# Altium schematic sheet AIM2 - MOD REVB.SchDoc: Modification Information
size B; DrawnBy: DJW; DocumentNumber: 10; SheetNumber: 10; SheetTotal: 12
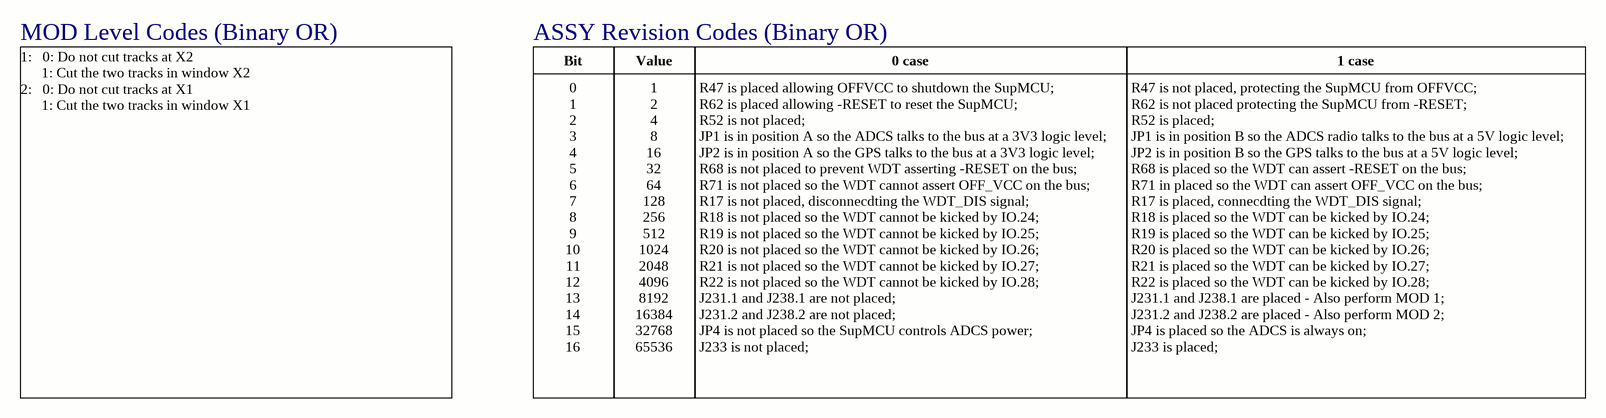
[diagram p0: AIM2 - MOD REVB.SchDoc]

## Notes on the sheet
- MOD Level Codes (Binary OR)
- ASSY Revision Codes (Binary OR)
- Bit
- Value
- 0 case
- 1 case
- 1:   0: Do not cut tracks at X2
  1: Cut the two tracks in window X2
  2:   0: Do not cut tracks at X1
  1: Cut the two tracks in window X1
- 0
  1
  2
  3
  4
  5
  6
  7
  8
  9
  10
  11
  12
  13
  14
  15
  16
- 1
  2
  4
  8
  16
  32
  64
  128
  256
  512
  1024
  2048
  4096
  8192
  16384
  32768
  65536
- R47 is placed allowing OFFVCC to shutdown the SupMCU;
  R62 is placed allowing -RESET to reset the SupMCU;
  R52 is not placed;
  JP1 is in position A so the ADCS talks to the bus at a 3V3 logic level;
  JP2 is in position A so the GPS talks to the bus at a 3V3 logic level;
  R68 is not placed to prevent WDT asserting -RESET on the bus;
  R71 is not placed so the WDT cannot assert OFF_VCC on the bus;
  R17 is not placed, disconnecdting the WDT_DIS signal;
  R18 is not placed so the WDT cannot be kicked by IO.24;
  R19 is not placed so the WDT cannot be kicked by IO.25;
  R20 is not placed so the WDT cannot be kicked by IO.26;
  R21 is not placed so the WDT cannot be kicked by IO.27;
  R22 is not placed so the WDT cannot be kicked by IO.28;
  J231.1 and J238.1 are not placed;
  J231.2 and J238.2 are not placed;
  JP4 is not placed so the SupMCU controls ADCS power;
  J233 is not placed;
- R47 is not placed, protecting the SupMCU from OFFVCC;
  R62 is not placed protecting the SupMCU from -RESET;
  R52 is placed;
  JP1 is in position B so the ADCS radio talks to the bus at a 5V logic level;
  JP2 is in position B so the GPS talks to the bus at a 5V logic level;
  R68 is placed so the WDT can assert -RESET on the bus;
  R71 in placed so the WDT can assert OFF_VCC on the bus;
  R17 is placed, connecdting the WDT_DIS signal;
  R18 is placed so the WDT can be kicked by IO.24;
  R19 is placed so the WDT can be kicked by IO.25;
  R20 is placed so the WDT can be kicked by IO.26;
  R21 is placed so the WDT can be kicked by IO.27;
  R22 is placed so the WDT can be kicked by IO.28;
  J231.1 and J238.1 are placed - Also perform MOD 1;
  J231.2 and J238.2 are placed - Also perform MOD 2;
  JP4 is placed so the ADCS is always on;
  J233 is placed;
- Title:
- 750 Naples Street
- San Francisco, California  94112
- Doc. Rev: 01
- File:
- Part Number:
- Revision:
- Sheet:
- (C) 2001-2017 Pumpkin, Inc.
- Date:
- Size:
- B
- Drawn By: